# Altium project 81801.PrjPcb
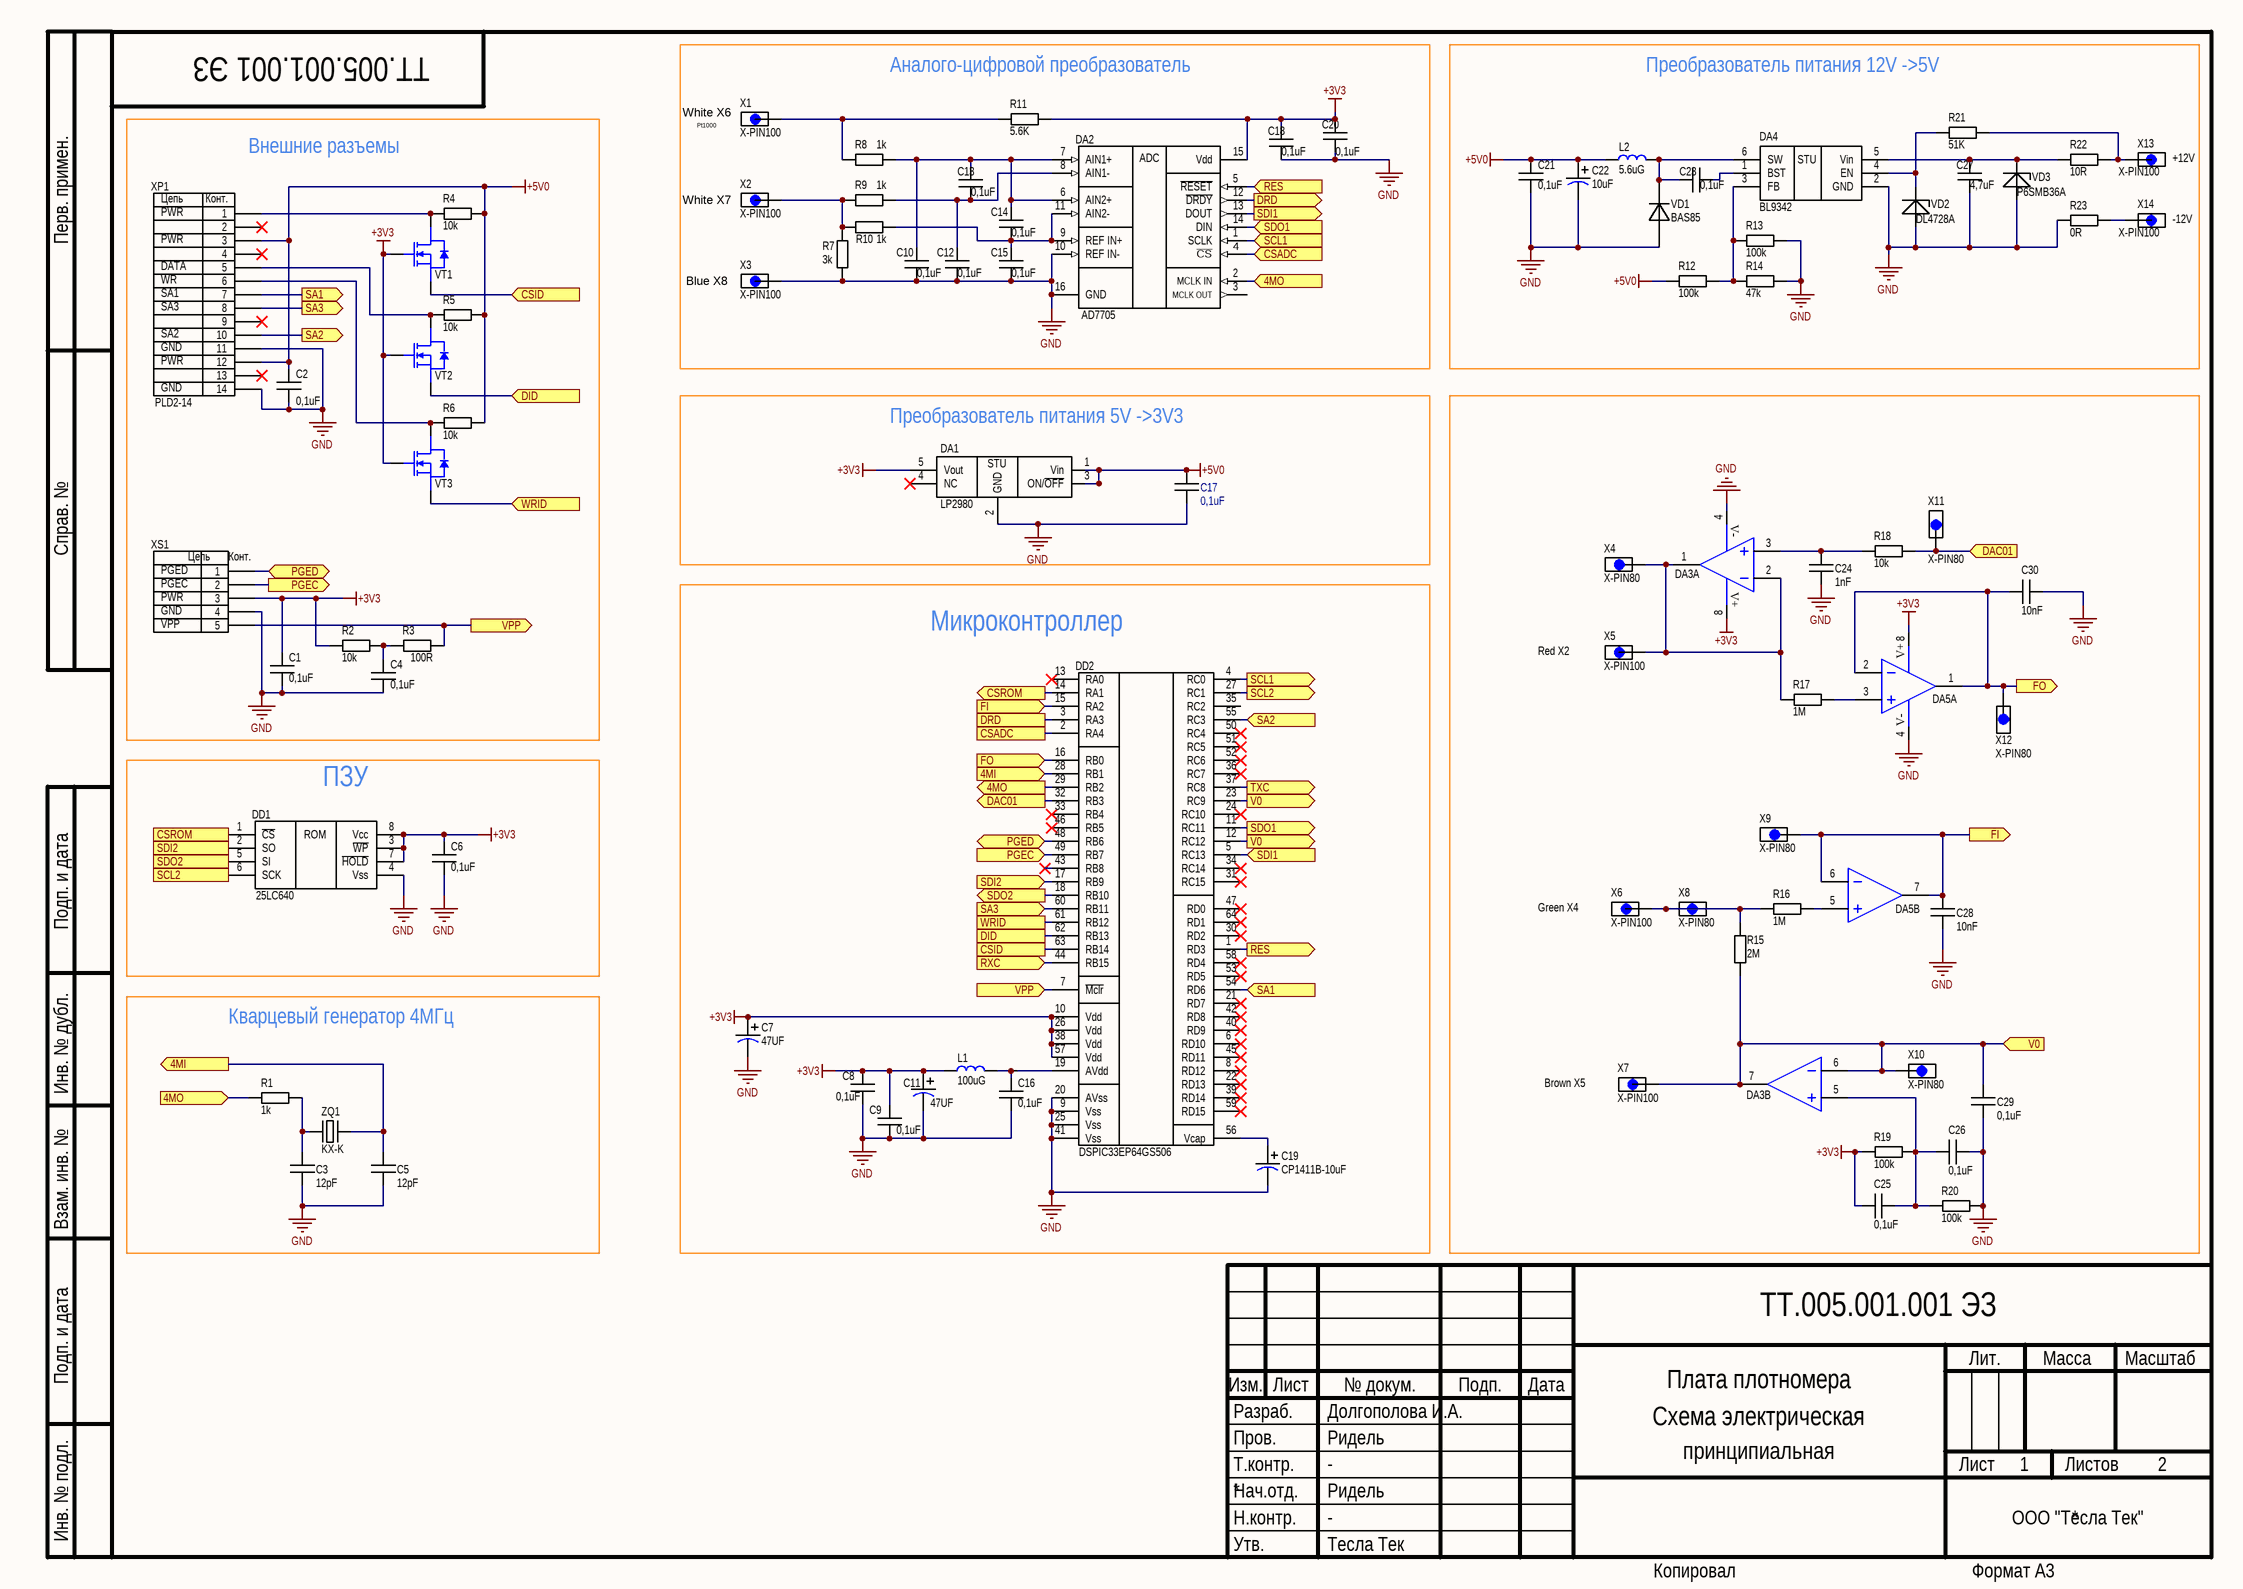
[diagram p0: Sheet1.SCHDOC]
1 sheet, 85 parts. Net scope: global (net labels, ports and power ports of the same name join across sheets).

## Sheet Sheet1.SCHDOC
size 420 x 297 mm; SheetNumber: 1; SheetTotal: 1; Разраб.: Долгополова И.А.; Обозначение документа: TT.005.001.001 ЭЗ; Пров.: Ридель; Т.контр.: -; Н.контр.: -; Утв.: Тесла Тек; Номер листа: 1; Общее количество листов: 2; Наименование организации: ООО "Тесла Тек"; Наименование изделия 1: Плата плотномера; Наименование изделия 2: Схема электрическая; Наименование изделия 3: принципиальная; Нач. отд.: Нач.отд.; Фамилия нач. отд.: Ридель; DocumentName: Sheet1.SCHDOC

### Parts
C1  0,1uF  [0805C]
C2  0,1uF  [0805C]
C3  12pF  [0805C]
C4  0,1uF  [0805C]
C5  12pF  [0805C]
C6  0,1uF  [0805C]
C7  47UF  [B1411_3528]
C8  0,1uF  [0805C]
C9  0,1uF  [0805C]
C10  0,1uF  [0805C]
C11  47UF  [B1411_3528]
C12  0,1uF  [0805C]
C13  0,1uF  [0805C]
C14  0,1uF  [0805C]
C15  0,1uF  [0805C]
C16  0,1uF  [0805C]
C17  0,1uF  [0805C]
C18  0,1uF  [0805C]
C19  CP1411B-10uF  [B1411_3528]
C20  0,1uF  [0805C]
C21  0,1uF  [0805C]
C22  10uF  [B1411_3528]
C23  0,1uF  [0805C]
C24  1nF  [0805C]
C25  0,1uF  [0805C]
C26  0,1uF  [0805C]
C27  4,7uF  [0805C]
C28  10nF  [0805C]
C29  0,1uF  [0805C]
C30  10nF  [0805C]
DA1  LP2980  [SOT23-5]
DA2  AD7705  [SOIC-16]
DA3  TP6002-SR  [SOIC-8]  (value not drawn)  (parts A,B of 2)
DA4  BL9342  [SOT23-6]
DA5  TP6002-SR  [SOIC-8]  (value not drawn)  (parts A,B of 2)
DD1  25LC640  [SOIC-8]
DD2  DSPIC33EP64GS506  [TQFP-64]
L1  100uG  [L1206]
L2  5.6uG  [L1210]
R1  1k  [R1206]
R2  10k  [R0805]
R3  100R  [R1206]
R4  10k  [R0805]
R5  10k  [R0805]
R6  10k  [R0805]
R7  3k  [R1206]
R8  1k  [R1206]
R9  1k  [R1206]
R10  1k  [R1206]
R11  5.6K  [R1206]
R12  100k  [R1206]
R13  100k  [R1206]
R14  47k  [R1206]
R15  2M  [R1206]
R16  1M  [R1206]
R17  1M  [R1206]
R18  10k  [R0805]
R19  100k  [R1206]
R20  100k  [R1206]
R21  51K  [R1206]
R22  10R  [R1206]
R23  0R  [R1206]
VD1  BAS85  [SOD-80 MiniMELF]
VD2  DL4728A  [DO-213AB]
VD3  P6SMB36A  [SMB(DO-214AA )]
VT1  VT-MOSFET-N-SOT23  [SOT-23-3]  (value not drawn)
VT2  VT-MOSFET-N-SOT23  [SOT-23-3]  (value not drawn)
VT3  VT-MOSFET-N-SOT23  [SOT-23-3]  (value not drawn)
X1  X-PIN100  [Xpin100]
X2  X-PIN100  [Xpin100]
X3  X-PIN100  [Xpin100]
X4  X-PIN80  [Xpin80]
X5  X-PIN100  [Xpin100]
X6  X-PIN100  [Xpin100]
X7  X-PIN100  [Xpin100]
X8  X-PIN80  [Xpin80]
X9  X-PIN80  [Xpin80]
X10  X-PIN80  [Xpin80]
X11  X-PIN80  [Xpin80]
X12  X-PIN80  [Xpin80]
X13  X-PIN100  [Xpin100]
X14  X-PIN100  [Xpin100]
XP1  PLD2-14  [PLD-14- 2.0mm]  (value not drawn)
XS1  PBS2-5  [PBS-5]  (value not drawn)
ZQ1  KX-K  [HC|49US]

### Blocks framed on the sheet
Аналого-цифровой преобразователь: C10 C12-C15 C18 C20 DA2 R7-R11 X1-X3
Преобразователь питания 12V ->5V: C21-C23 C27 DA4 L2 R12-R14 R21-R23 VD1-VD3 X13 X14
Внешние разъемы: C1 C2 C4 R2-R6 VT1-VT3 XP1 XS1
Преобразователь питания 5V ->3V3: C17 DA1
Микроконтроллер: C7-C9 C11 C16 C19 DD2 L1
ПЗУ: C6 DD1
Кварцевый генератор 4МГц: C3 C5 R1 ZQ1

### Ports
4MI (in), 4MI (out), 4MO (in), 4MO (out), CSADC, CSADC (in), CSID, CSID (in), CSROM (in), CSROM (out), DAC01 (in), DAC01 (out), DID, DID (in), DRD, DRD (out), FI (in), FI (out), FO (in), FO (out), PGEC (in), PGEC (out), PGED (bidir), RES (in), RES (out), RXC (in), SA1 (in), SA1 (out), SA2 (in), SA2 (out), SA3 (in), SA3 (out), SCL1 (in), SCL1 (out), SCL2 (in), SCL2 (out), SDI1 (in), SDI1 (out), SDI2 (in), SDI2 (out), SDO1 (in), SDO1 (out), SDO2 (in), SDO2 (out), TXC (out), V0 (in), V0 (out), VPP (in), VPP (out), WRID, WRID (in)

### Nets
+3V3: C1.1 C6.2 C7.1 C8.1 C9.1 C11.1 C18.2 C20.1 C25.1 DA1.5(Vout) DA2.15(Vdd) DA3.8 DA5.8 DD1.3(~{WP}) DD1.7(~{HOLD}) DD1.8(Vcc) DD2.10(Vdd) DD2.26(Vdd) DD2.38(Vdd) DD2.57(Vdd) L1.1 R2.1 R11.2 R19.1 VT1.1 VT2.1 VT3.1 XS1.3
+5V0: C2.1 C17.1 C21.1 C22.1 DA1.1(Vin) DA1.3(ON/~{OFF}) L2.1 R4.2 R5.2 R6.2 R12.1 XP1.3 XP1.12
GND: C1.2 C2.2 C3.2 C4.2 C5.2 C6.1 C7.2 C8.2 C9.2 C10.2 C11.2 C12.2 C15.2 C16.2 C17.2 C18.1 C19.2 C20.2 C21.2 C22.2 C24.1 C26.2 C27.2 C28.2 C29.2 C30.2 DA1.2(GND) DA2.10(REF_IN-) DA2.16(GND) DA3.4 DA4.2(GND) DA5.4 DD1.4(Vss) DD2.9(Vss) DD2.20(AVss) DD2.25(Vss) DD2.41(Vss) R7.1 R13.2 R14.2 R20.1 R23.1 VD1.1(A) VD2.1(A) VD3.1(A) X3.1 XP1.11 XP1.14 XS1.4
4MI: C5.1 DD2.28(RB1) ZQ1.2(OSC2) ; port 4MI
4MO: DA2.2(MCLK_IN) DD2.29(RB2) R1.1 ; port 4MO
CSADC: DA2.4(~{CS}) DD2.2(RA4) ; port CSADC
CSID: DD2.63(RB14) VT1.2 ; port CSID
CSROM: DD1.1(~{CS}) DD2.14(RA1) ; port CSROM
DAC01: DD2.32(RB3) R18.2 X11.1(Contact0) ; port DAC01
DID: DD2.62(RB13) VT2.2 ; port DID
DRD: DA2.12(~{DRDY}) DD2.3(RA3) ; port DRD
FI: C28.1 DA5.6 DA5.7 DD2.15(RA2) X9.1(Contact0) ; port FI
FO: C30.1 DA5.1 DA5.2 DD2.16(RB0) X12.1(Contact0) ; port FO
PGEC: DD2.49(RB7) XS1.2 ; port PGEC
PGED: DD2.48(RB6) XS1.1 ; port PGED
RES: DA2.5(~{RESET}) DD2.1(RD3) ; port RES
RXC: DD2.44(RB15) ; port RXC
SA1: DD2.54(RD6) XP1.7 ; port SA1
SA2: DD2.55(RC3) XP1.10 ; port SA2
SA3: DD2.60(RB11) XP1.8 ; port SA3
SCL1: DA2.1(SCLK) DD2.4(RC0) ; port SCL1
SCL2: DD1.6(SCK) DD2.27(RC1) ; port SCL2
SDI1: DA2.13(DOUT) DD2.5(RC13) ; port SDI1
SDI2: DD1.2(SO) DD2.17(RB9) ; port SDI2
SDO1: DA2.14(DIN) DD2.11(RC11) ; port SDO1
SDO2: DD1.5(SI) DD2.18(RB10) ; port SDO2
TXC: DD2.37(RC8) ; port TXC
V0: C29.1 DA3.6 DA3.7 DD2.12(RC12) DD2.23(RC9) R15.1 X7.1 X10.1(Contact0) ; port V0
VPP: DD2.7(~{Mclr}) R3.2 XS1.5 ; port VPP
WRID: DD2.61(RB12) VT3.2 ; port WRID
NetC3_1: C3.1 R1.2 ZQ1.1(OSC1)
NetC4_1: C4.1 R2.2 R3.1
NetC10_1: C10.1 C13.1 C14.1 DA2.6(AIN2+) DA2.7(AIN1+) R8.2
NetC12_1: C12.1 C13.2 DA2.8(AIN1-) R9.2
NetC14_2: C14.2 C15.1 DA2.9(REF_IN+) DA2.11(AIN2-) R10.2
NetC16_1: C16.1 DD2.19(AVdd) L1.2
NetC19_1: C19.1 DD2.56(Vcap)
NetC23_1: C23.1 DA4.6(SW) L2.2 VD1.2(K)
NetC23_2: C23.2 DA4.1(BST)
NetC24_2: C24.2 DA3.3 R18.1
NetC25_2: C25.2 C26.1 DA3.5 R19.2 R20.2
NetC27_1: C27.1 DA4.5(Vin) R22.1 VD3.2(K)
NetDA3_1: DA3.1 DA3.2 R17.1 X4.1(Contact0) X5.1
NetDA4_3: DA4.3(FB) R12.2 R13.1 R14.1
NetDA4_4: DA4.4(EN) R21.2 VD2.2(K)
NetDA5_3: DA5.3 R17.2
NetDA5_5: DA5.5 R16.2
NetR4_1: R4.1 VT1.3 VT1.6 XP1.1
NetR5_1: R5.1 VT2.3 VT2.6 XP1.5
NetR6_1: R6.1 VT3.3 VT3.6 XP1.6
NetR7_2: R7.2 R9.1 R10.1 X2.1
NetR8_1: R8.1 R11.1 X1.1
NetR15_2: R15.2 R16.1 X6.1 X8.1(Contact0)
NetR21_1: R21.1 R22.2 X13.1
NetR23_2: R23.2 X14.1

Not connected (* = marked no-connect by the designer): DA1 4; DA2 3(MCLK_OUT); DD2 6(RD10)* 8(RD12)* 13(RA0)* 21(RD7)* 22(RD13)* 24(RC10)* 30(RD2)* 31(RC15)* 33(RB4)* 34(RC14)* 35(RC2) 36(RC7)* 39(RD14)* 40(RD9)* 42(RD8)* 43(RB8)* 45(RD11)* 46(RB5)* 47(RD0)* 50(RC4)* 51(RC5)* 52(RC6)* 53(RD5)* 58(RD4)* 59(RD15)* 64(RD1)*; XP1 2* 4* 9* 13*

### Notes on the sheet
- (near X1) Pt1000
- (near X1) White X6
- (near X13) +12V
- PWR
- (near X2) White X7
- (near X14) -12V
- (near XP1) DATA
- WR
- SA1
- SA3
- (near X3) Blue X8
- SA2
- GND
- (near XP1) PLD2-14
- (near XS1) PGED
- (near XS1) PGEC
- (near XS1) PWR
- (near XS1) GND
- (near XS1) VPP
- Red X2
- (near X6) Green X4
- (near X7) Brown X5
- Перв. примен.
- Справ. №
- Подп. и дата
- Инв. № дубл.
- Взам. инв. №
- Разраб.
- Изм.
- Лист
- № докум.
- Подп.
- Дата
- Лит.
- Масса
- Масштаб
- Пров.
- Т.контр.
- Листов
- Инв. № подл.
- Утв.
- Н.контр.
- Копировал
- Формат А3
- (in symbol 25LC640) ROM
- (in symbol BL9342) STU
- (in symbol DA-ADC-AD7705SO) ADC
- (in symbol DA-STU-LP2980) STU
- (in symbol PBS2-5) Цепь; Конт.
- (in symbol PLD2-14) Цепь; Конт.
- (in symbol TP6002-SR, part A) V-; V+

### Library data of the parts
C1 C2 C4 C6 C8-C10 C12-C18 C20 C21 C23 C25 C26 C29 = C0805-0,1uF: C0805 0,1uF; Part Number: SMD CAP CER 0.1uF ±10% 25V X7R 0805; Added_by: ridel_av@teslatec.ru; Pkg: 0805; Solder_Amount: 2; Created_at: 21/04/2025; Mount: MOUNT; MountType: SMD
C3 C5 = C0805-12pF: C0805 12pF; Part Number: SMD CAP CER 12pF ±10% 10V X7R 0805; Added_by: ridel_av@teslatec.ru; Pkg: 0805; Solder_Amount: 2; Created_at: 21/04/2025; Mount: MOUNT; MountType: SMD
C7 C11 = CP1411B-47UF: CP1411B 47UF 6V3; Part Number: SMD CAP TANTAL 47uF ±10% 6V3 1411B; Added_by: ridel_av@teslatec.ru; Pkg: 1411B; Solder_Amount: 2; Created_at: 21/04/2025; Mount: MOUNT; MountType: SMD
C19 = CP1411B-10uF: CP1411B 10uF 6V3; Part Number: SMD CAP TANTAL 10uF ±10% 6V3 1411B; Added_by: ridel_av@teslatec.ru; Pkg: 1411B; Solder_Amount: 2; Created_at: 21/04/2025; Mount: MOUNT; MountType: SMD
C22 = CP1411B-10uF-10V: CP1411B 10uF 10V; Part Number: SMD CAP TANTAL 10uF ±10% 10V 1411B; Added_by: ridel_av@teslatec.ru; Pkg: 1411B; Solder_Amount: 2; Created_at: 21/04/2025; Mount: MOUNT; MountType: SMD
C24 = C0805-1nF: C0805 1nF; Part Number: SMD CAP CER 1nF ±10% 50V X7R 0805; Added_by: ridel_av@teslatec.ru; Pkg: 0805; Solder_Amount: 2; Created_at: 21/04/2025; Mount: MOUNT; MountType: SMD
C27 = C0805-4,7uF: C0805 4,7uF 50V; Part Number: SMD CAP CER 4.7uF ±10% 50V X7R 0805; Added_by: ridel_av@teslatec.ru; Pkg: 0805; Solder_Amount: 2; Created_at: 21/04/2025; Mount: MOUNT; MountType: SMD
C28 C30 = C0805-10nF: C0805 10nF; Part Number: SMD CAP CER 10nF ±10% 50V X7R 0805; Added_by: ridel_av@teslatec.ru; Pkg: 0805; Solder_Amount: 2; Created_at: 21/04/2025; Mount: MOUNT; MountType: SMD
DA1 = DA-STU-LP2980: DA-STU-LP2980, 3.3V, 50mA; Part Number: LP2980IM5X-3.3/NOPB; Added_by: ridel_av@teslatec.ru; Solder_Amount: 5; Created_at: 21/04/2025; Mount: MOUNT; MountType: SMD; Pkg: SOT23-5
DA2 = DA-ADC-AD7705SO: DA-ADC-AD7705; Part Number: AD7705BR; Added_by: ridel_av@teslatec.ru; Solder_Amount: 16; Created_at: 21/04/2025; Mount: MOUNT; MountType: SMD; Pkg: SOIC-16
DA3 DA5 = TP6002-SR: 100 mA Output Single-Supply Amplifier; Added_by: ridel_av@teslatec.ru; Solder_Amount: 8; Created_at: 21/04/2025; Mount: MOUNT; MountType: SMD; Part Number: TP6002-SR; Pkg: SOIC-8
DA4 = BL9342: STU-BL9342, 40V, 600mA; Added_by: ridel_av@teslatec.ru; Solder_Amount: 6; Created_at: 21/04/2025; Mount: MOUNT; MountType: SMD; Part Number: BL9342; Pkg: SOT23-6
DD1 = 25LC640: 25LC640-E/SN, EEPROM, 64Kbit, 2MHz, SPI; Added_by: ridel_av@teslatec.ru; Solder_Amount: 8; Created_at: 21/04/2025; Mount: MOUNT; MountType: SMD; Part Number: 25LC640-E/SN; Pkg: SOIC-8
DD2 = DD-CPU-DSPIC33EPXXGS506: DD-CPU-DSPIC33EP64GS506; Added_by: ridel_av@teslatec.ru; Solder_Amount: 64; Created_at: 21/04/2025; Mount: MOUNT; MountType: SMD; Part Number: DSPIC33EP64GS506; Pkg: TQFP-64
L1 = L1206-100uG: LQH31CN101K03L, 100 uG, 1206, 10%; Added_by: ridel_av@teslatec.ru; Pkg: 1206; Solder_Amount: 2; Created_at: 21/04/2025; Mount: MOUNT; MountType: SMD; Part Number: LQH31CN101K03L
L2 = L1210-5.6uG: LQH32MN5R6K23L, 5.6uG, 1210, 10%; Added_by: ridel_av@teslatec.ru; Pkg: 1210; Solder_Amount: 2; Created_at: 21/04/2025; Mount: MOUNT; MountType: SMD; Part Number: LQH32MN5R6K23L
R1 R8-R10 = R1206-1k: R1206 SMD 1k OHM 1% ±100ppm/°C; Part Number: SMD RES 1k OHM 1% ±100ppm/°C 1206; Added_by: ridel_av@teslatec.ru; Pkg: 1206; Solder_Amount: 2; Created_at: 21/04/2025; Mount: MOUNT; MountType: SMD
R2 R4-R6 R18 = R0805-10k: R0805 SMD 10k OHM 1% ±100ppm/°C; Part Number: SMD RES 10k OHM 1% ±100ppm/°C 0805; Added_by: ridel_av@teslatec.ru; Pkg: 0805; Solder_Amount: 2; Created_at: 21/04/2025; Mount: MOUNT; MountType: SMD
R3 = R1206-100R: R1206 100 OHM 1% ±100ppm/°C; Part Number: SMD RES 100 OHM 1% ±100ppm/°C 1206; Added_by: ridel_av@teslatec.ru; Pkg: 1206; Solder_Amount: 2; Created_at: 21/04/2025; Mount: MOUNT; MountType: SMD
R7 = R1206-3k: R1206 SMD 3k OHM 1% ±100ppm/°C; Part Number: SMD RES 1k OHM 1% ±100ppm/°C 1206; Added_by: ridel_av@teslatec.ru; Pkg: 1206; Solder_Amount: 2; Created_at: 21/04/2025; Mount: MOUNT; MountType: SMD
R11 = R1206-5.6K: R1206 5.6k OHM 1% ±100ppm/°C; Part Number: SMD RES 5.6k OHM 1% ±100ppm/°C 1206; Added_by: ridel_av@teslatec.ru; Pkg: 1206; Solder_Amount: 2; Created_at: 21/04/2025; Mount: MOUNT; MountType: SMD
R12 R13 R19 R20 = R1206-100k: R1206 100k OHM 1% ±100ppm/°C; Part Number: SMD RES 100k OHM 1% ±100ppm/°C 1206; Added_by: ridel_av@teslatec.ru; Pkg: 1206; Solder_Amount: 2; Created_at: 21/04/2025; Mount: MOUNT; MountType: SMD
R14 = R1206-47k: R1206 47k OHM 1% ±100ppm/°C; Part Number: SMD RES 47k OHM 1% ±100ppm/°C 1206; Added_by: ridel_av@teslatec.ru; Pkg: 1206; Solder_Amount: 2; Created_at: 21/04/2025; Mount: MOUNT; MountType: SMD
R15 = R1206-2M: R1206 2M OHM 1% ±100ppm/°C; Part Number: SMD RES 2M OHM 1% ±100ppm/°C 1206; Value: 1M; Added_by: ridel_av@teslatec.ru; Pkg: 1206; Solder_Amount: 2; Created_at: 21/04/2025; Mount: MOUNT; MountType: SMD
R16 R17 = R1206-1M: R1206 1M OHM 1% ±100ppm/°C; Part Number: SMD RES 1M OHM 1% ±100ppm/°C 1206; Added_by: ridel_av@teslatec.ru; Pkg: 1206; Solder_Amount: 2; Value: 1M; Created_at: 21/04/2025; Mount: MOUNT; MountType: SMD
R21 = R1206-51K: R1206 51K OHM 1% ±100ppm/°C; Part Number: SMD RES 51K OHM 1% ±100ppm/°C 1206; Added_by: ridel_av@teslatec.ru; Pkg: 1206; Solder_Amount: 2; Created_at: 21/04/2025; Mount: MOUNT; MountType: SMD
R22 = R1206-10R: R1206 10 OHM 1% ±100ppm/°C; Part Number: SMD RES 10 OHM 1% ±100ppm/°C 1206; Added_by: ridel_av@teslatec.ru; Pkg: 1206; Solder_Amount: 2; Created_at: 21/04/2025; Mount: MOUNT; MountType: SMD
R23 = R1206-0R: Part Number: SMD RES 0 OHM 1% ±100ppm/°C 1206; Added_by: ridel_av@teslatec.ru; Pkg: 1206; Solder_Amount: 2; Created_at: 21/04/2025; Mount: MOUNT; MountType: SMD
VD1 = BAS85: BAS85 30В 0.2А; Added_by: ridel_av@teslatec.ru; Pkg: SOD-80; Solder_Amount: 2; Value: BAS85; Created_at: 21/04/2025; Mount: MOUNT; MountType: SMD; Part Number: BAS85
VD2 = DL4728A: DL4728A, 3V3; Added_by: ridel_av@teslatec.ru; Pkg: DO-213AA; Solder_Amount: 2; Created_at: 21/04/2025; Mount: MOUNT; MountType: SMD; Part Number: DL4728A
VD3 = P6SMB36A: P6SMB36A, 49.9V; Added_by: ridel_av@teslatec.ru; Pkg: SMB (DO-214AA); Solder_Amount: 2; Created_at: 21/04/2025; Mount: MOUNT; MountType: SMD; Part Number: P6SMB36A
VT1-VT3 = 2N7002: 2N7002, MOSFET-N, 60V, 115mA, SOT-23-3; Added_by: ridel_av@teslatec.ru; Pkg: SOT23-3; Solder_Amount: 3; Created_at: 21/04/2025; Mount: MOUNT; MountType: SMD; Part Number: 2N7002
X1-X3 X5-X7 X13 X14 = X-PIN100: Added_by: ridel_av@teslatec.ru; Solder_Amount: 2; Created_at: 21/04/2025; Mount: MOUNT; MountType: SMD
X4 X8-X12 = X-PIN80: Added_by: ridel_av@teslatec.ru; Solder_Amount: 2; Created_at: 21/04/2025; Mount: MOUNT; MountType: SMD
XP1 = PLD2-14: Part Number: DS1025-05-2X7P8BV1-B; Added_by: ridel_av@teslatec.ru; Solder_Amount: 14; Created_at: 21/04/2025; Mount: MOUNT; MountType: SMD; Pkg: PLD2-14
XS1 = PBS2-5: Part Number: C6801-05ASGL00R; Added_by: ridel_av@teslatec.ru; Solder_Amount: 2; Created_at: 21/04/2025; Mount: MOUNT; MountType: PTH; Pkg: PBS2-5
ZQ1 = ABLS-4.000MHZ-K4T: KX-K 4MHz HC/49US; Added_by: ridel_av@teslatec.ru; Pkg: HC/49US  (SMD-2); Solder_Amount: 2; Created_at: 21/04/2025; Mount: MOUNT; MountType: SMD; Part Number: ABLS-4.000MHZ-K4T